# Altium schematic sheet Sheet3.SchDoc
size A4; SheetNumber: 3; SheetTotal: 6
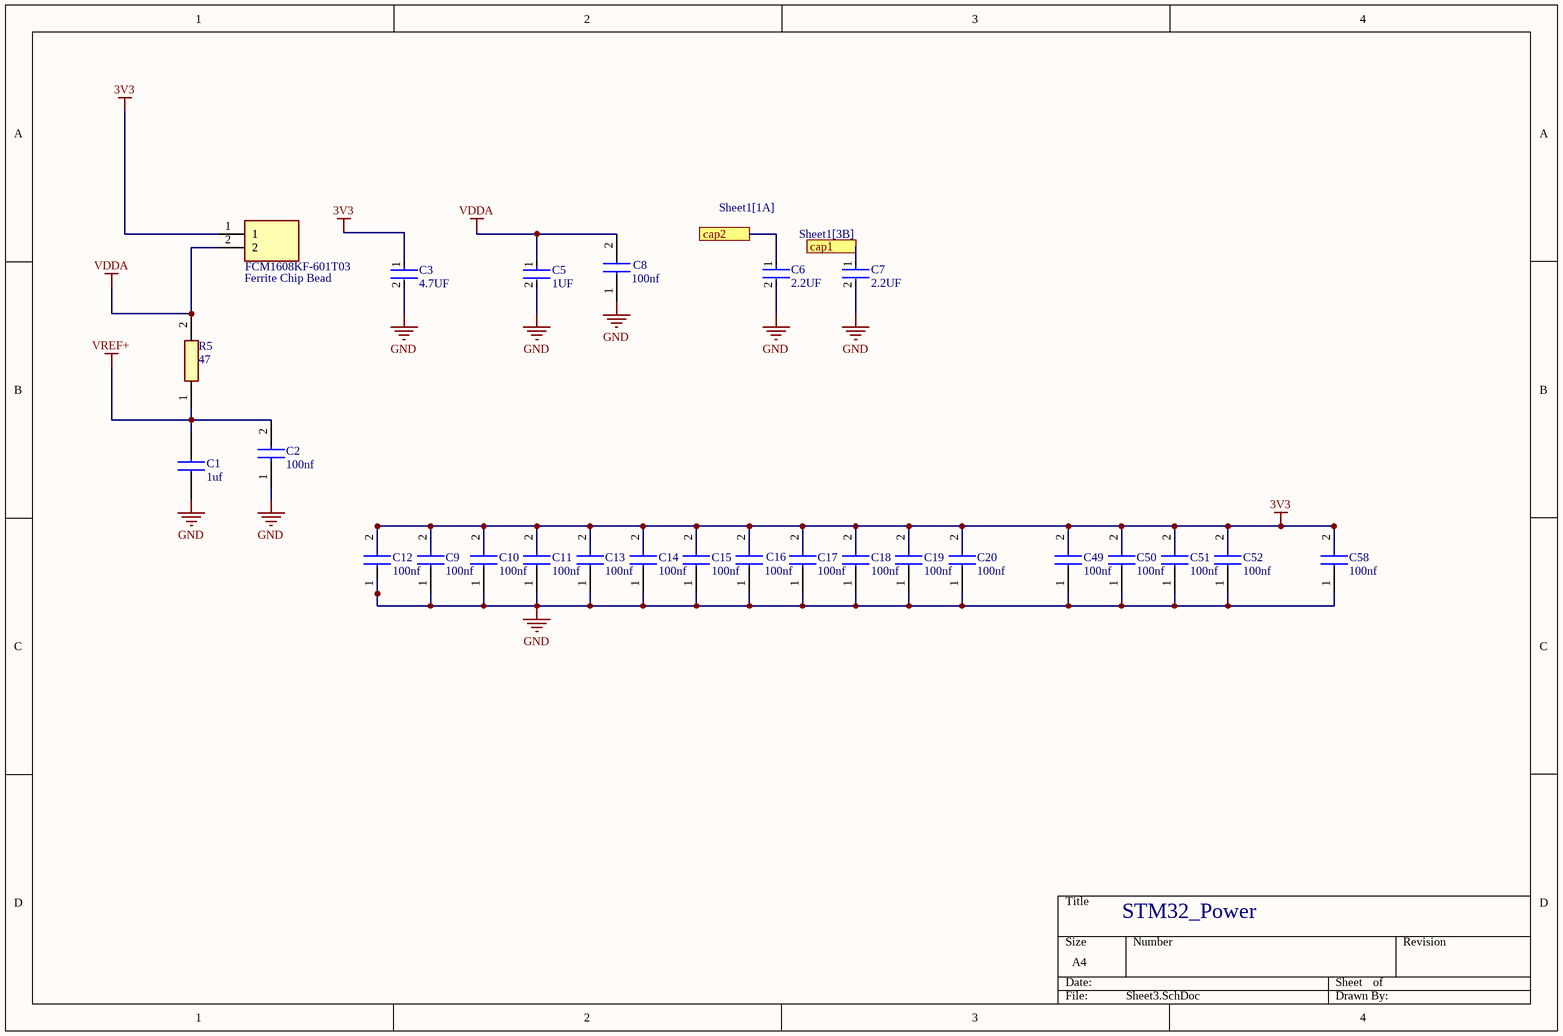
[diagram p0: Sheet3.SchDoc]

## Parts
C1  1uf  [CAPC1608X95N]
C2  100nf  [CAPC1608X95N]
C3  4.7UF  [FP-CL10-IPC_A]
C5  1UF  [FP-CL10-IPC_A]
C6  2.2UF  [FP-CL10-IPC_A]
C7  2.2UF  [FP-CL10-IPC_A]
C8  100nf  [CAPC1608X95N]
C9  100nf  [CAPC1608X95N]
C10  100nf  [CAPC1608X95N]
C11  100nf  [CAPC1608X95N]
C12  100nf  [CAPC1608X95N]
C13  100nf  [CAPC1608X95N]
C14  100nf  [CAPC1608X95N]
C15  100nf  [CAPC1608X95N]
C16  100nf  [CAPC1608X95N]
C17  100nf  [CAPC1608X95N]
C18  100nf  [CAPC1608X95N]
C19  100nf  [CAPC1608X95N]
C20  100nf  [CAPC1608X95N]
C49  100nf  [CAPC1608X95N]
C50  100nf  [CAPC1608X95N]
C51  100nf  [CAPC1608X95N]
C52  100nf  [CAPC1608X95N]
C58  100nf  [CAPC1608X95N]
Ferrite_Chip_Bead  FCM1608KF-601T03  [BEADC1608X95N]
R5  47  [RESC1608X55N]

## Ports
cap1 (see Sheet1[3B]), cap2 (see Sheet1[1A])

## Nets
3V3: C3.1 C9.2 C10.2 C11.2 C12.2 C13.2 C14.2 C15.2 C16.2 C17.2 C18.2 C19.2 C20.2 C49.2 C50.2 C51.2 C52.2 C58.2 Ferrite_Chip_Bead.1
GND: C1.1 C2.1 C3.2 C5.2 C6.2 C7.2 C8.1 C9.1 C10.1 C11.1 C12.1 C13.1 C14.1 C15.1 C16.1 C17.1 C18.1 C19.1 C20.1 C49.1 C50.1 C51.1 C52.1 C58.1
VDDA: C5.1 C8.2 Ferrite_Chip_Bead.2 R5.2
VREF+: C1.2 C2.2 R5.1
cap1: C7.1 ; port cap1
cap2: C6.1 ; port cap2

## Notes on the sheet
- STM32_Power

## Library data of the parts
C1 = 0603X105K250CT: WALSIN - 0603X105K250CT - SMD Multilayer Ceramic Capacitor, 1 F, 25 V, 0603 [1608 Metric], +/- 10%, X5R; Manufacturer_Name: Walsin Technology Corporation; Geometry.Height: 0.95mm; Manufacturer_Part_Number: 0603X105K250CT; Mouser Part Number: *; Mouser Price/Stock: *; Arrow Part Number: *; Arrow Price/Stock: *; Datasheet Link: https://g.componentsearchengine.com/Datasheets/2/0603X105K250CT.pdf
C2 C8-C20 C49-C52 C58 = VJ0603Y104KXACW1BC: Capacitor; Manufacturer_Name: Vishay; Datasheet Link: https://componentsearchengine.com/Datasheets/2/VJ0603Y104KXACW1BC.pdf; Height: 0.95mm; Manufacturer_Part_Number: VJ0603Y104KXACW1BC; Mouser Part Number: N/A; Mouser Price/Stock: https://www.mouser.co.uk/ProductDetail/Vishay-Vitramon/VJ0603Y104KXACW1BC?qs=M%2FcR%2FDpCXFVPJpohemA31Q%3D%3D; Arrow Part Number: VJ0603Y104KXACW1BC; Arrow Price/Stock: https://www.arrow.com/en/products/vj0603y104kxacw1bc/vishay?utm_currency=USD&region=nac
C3 C5-C7 = CMP-13271-003582-1: Cap Ceramic 2.2uF 10V X7R ±10% Pad SMD 0603 +125°C T/R; Max Operating Temperature: 125°C; Package Quantity: 1; Thickness: 0.035inch; Capacitance: 2.2uF; Height: 0.8mm; Case/Package: 0603; Case Code (Metric): 1608; Radiation Hardening: No; Dielectric: X7R; Mount: Surface Mount; Contact Plating: Tin; Material: Ceramic; Length: 1.6mm; Packaging: Tape and Reel; Width: 0.031inch; Min Operating Temperature: -55°C; Case Code (Imperial): 0603; Depth: 0.8mm; Voltage Rating: 10V; Tolerance: 10%
Ferrite_Chip_Bead = FCM1608KF-601T03: Ferrite Bead; Manufacturer_Name: TAI-TECH; Datasheet Link: https://www.tai-tech.com.tw/_upload/files/FCM1608-Series.pdf; Height: 0.95mm; Manufacturer_Part_Number: FCM1608KF-601T03
R5 = RC0603FR-071KL: Resistor; Manufacturer_Name: YAGEO; Datasheet Link: https://www.yageo.com/upload/media/product/productsearch/datasheet/rchip/PYu-RC_Group_51_RoHS_L_12.pdf; Height: 0.55mm; Manufacturer_Part_Number: RC0603FR-071KL; Mouser Part Number: 603-RC0603FR-071KL; Mouser Price/Stock: https://www.mouser.co.uk/ProductDetail/YAGEO/RC0603FR-071KL?qs=VU8sRB4EgwApHsk4rF%2F3zg%3D%3D; Arrow Part Number: RC0603FR-071KL; Arrow Price/Stock: https://www.arrow.com/en/products/rc0603fr-071kl/yageo?utm_currency=USD&region=nac